# Altium schematic sheet Sheet3.SchDoc
size A; SheetNumber: 5; SheetTotal: 6
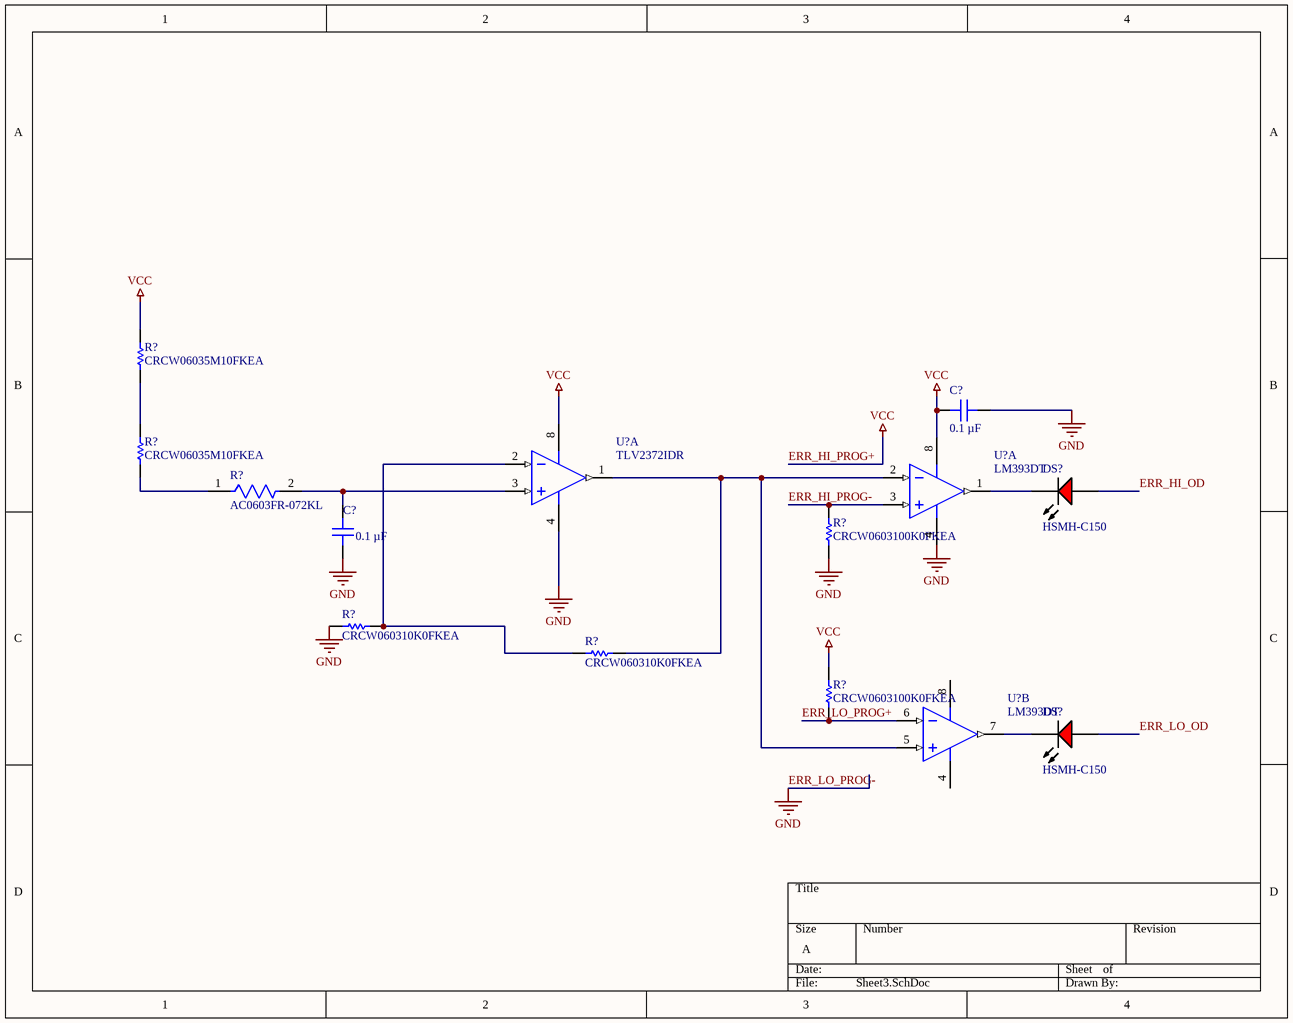
[diagram p0: Sheet3.SchDoc]

## Parts
(Parts that share a designator on the sheet are numbered #1, #2 ... from top to bottom, then left to right.)
C?#1  0.1 µF  [CAP 0603_1608]
C?#2  0.1 µF  [CAP 0603_1608]
DS?#1  HSMH-C150  [AVAG-HSMX-C150_V]
DS?#2  HSMH-C150  [AVAG-HSMX-C150_V]
R?#1  CRCW06035M10FKEA  [RESC1609X50X30NL10T20]
R?#2  CRCW06035M10FKEA  [RESC1609X50X30NL10T20]
R?#3  AC0603FR-072KL  [FP-AC0603-IPC_B]
R?#4  CRCW0603100K0FKEA  [RESC1609X50X30NL8T20]
R?#5  CRCW060310K0FKEA  [RESC1609X50X30NL8T20]
R?#6  CRCW060310K0FKEA  [RESC1609X50X30NL8T20]
R?#7  CRCW0603100K0FKEA  [RESC1609X50X30NL8T20]
U?#1  TLV2372IDR  [D0008A_M]  (part A of 2)
U?#2  LM393DT  [STM-SO-8_D_L]  (part A of 2)
U?#3  LM393DT  [STM-SO-8_D_L]  (part B of 2)

## Nets
ERR_HI_PROG+: C?#1.2 R?#1.2 R?#7.1 U?#1.8(VDD) U?#2.8(VCC+)  [also labelled VCC]
ERR_LO_PROG-: C?#1.1 C?#2.1 R?#4.2 R?#5.1 U?#1.4(GND) U?#2.4(VCC-)  [also labelled GND]
ERR_HI_OD: DS?#1.1(A)
ERR_HI_PROG-: R?#4.1 U?#2.3(IN1+)
ERR_LO_OD: DS?#2.1(A)
ERR_LO_PROG+: R?#7.2 U?#3.6(IN2-)
NetC?#2_2: C?#2.2 R?#3.2 U?#1.3(IN1+)
NetDS?#1_2: DS?#1.2(K) U?#2.1(OUT1)
NetDS?#2_2: DS?#2.2(K) U?#3.7(OUT2)
NetR?#1_1: R?#1.1 R?#2.2
NetR?#2_1: R?#2.1 R?#3.1
NetR?#5_2: R?#5.2 R?#6.1 U?#1.2(IN1-)
NetR?#6_2: R?#6.2 U?#1.1(OUT1) U?#2.2(IN1-) U?#3.5(IN2+)

Not connected (* = marked no-connect by the designer): U?#3 4(VCC-) 8(VCC+)

## Library data of the parts
C?#1 C?#2 = C0603X104J5RACAUTO: CAP CER 0.1UF 50V X7R 0603; manufacturer: KEMET; Tolerance: ±5%; Part Number: C0603X104J5RACAUTO; Value: 0.1 µF; Applications: Automotive, Boardflex Sensitive; Capacitance: 0.1 µF; componentlink1description: Datasheet; componentlink1url: https://api.kemet.com/component-edge/download/specsheet/C0603X104J5RACAUTO.pdf; componentlink2description: DigiKey Link; componentlink2url: https://www.digikey.com/en/products/detail/kemet/C0603X104J5RACAUTO/3314905; Device Package: 0603 (1608 Metric); Features: Soft Termination; lastupdated: 2/9/2024 8:10:26 PM; Lifecycle Status: Active; Minimum Order: 1; Mounting Type: Surface Mount, MLCC; Operating Temperature: -55°C ~ 125°C; Package / Case: 0603 (1608 Metric); packaging: TapeAndReel; partid: 40909; Part Status: Active; price: 0.12; Ratings: AEC-Q200; series: SMD Auto X7R Flex; Size / Dimension: 0.063" L x 0.031" W (1.60mm x 0.80mm); Supplier 1: DigiKey; Supplier Part Number 1: 399-6910-1-ND; Temperature Coefficient: X7R; Thickness (Max): 0.037" (0.95mm); Voltage - Rated: 50V
DS?#1 DS?#2 = CMP-2000-06426-1: LED Uni-Color Red, 65 mW, 25 mA, -40 to 85 degC, 2-Pin SMD, RoHS, Tape and Reel; Manufacturer: Avago; Product Height (mm): 1.1mm; Power Dissipation: 78W; Product Length (mm): 3.2mm; Forward Voltage: 2.6V; Luminous Intensity: 17mcd; DELETED: Compliant; Shape Type: Rectangular; Peak Wavelength: 660nm; Main Category: ChipLED; Dominant Wave Length: 639nm; Rad Hardened: No; Lens Type: ColorlessDiffused; Product Depth (mm): 1.6mm; Reverse Voltage: 5V; Forward Current: 25mA; Chip Material: GaAlAs; Test Current (It): 20mA; Viewing Angle: 170deg; Number of  Elements: 1; Type: Uni-Color; Package Reference: HSMX-C150; Package Description: 2-Pin Surface Mount Device, Body 3.2 x 1.6 mm; Operating Temp Range: -40Cto85C; Mounting: SurfaceMount; Emitting Color: Red; Pin Count: 2; Operating Temperature Classification: Industrial; Datasheet URL: http://media.digikey.com/pdf/Data%20Sheets/Avago%20PDFs/HSMz-Czzz.pdf; Package Type: ChipLed; Mounting Technology: SurfaceMount; High Brightness: No; Lens Dimensions: 2x1.6x0.6mm; Manufacturer URL: http://www.avagotech.com/; Lum Intensity: 17mcd; Datasheet Version: 03/2012; Packaging: TapeandReel
R?#1 R?#2 = CMP-2000-03491-1: Manufacturer: Vishay Dale; Part Number: CRCW06035M10FKEA
R?#3 = CMP-2000-04836-2: RES 2kΩ 1.00% 0.1W 0603; Resistance: 2kR; Voltage Rating: 50V; Max Power Dissipation: 100mW; Temperature Coefficient: 100ppm/°C; Tolerance: 1%; Height: 0.45mm; Case Code (Imperial): 0603; Number of Terminations: 2; Termination: SMD/SMT; Max Operating Temperature: 155°C; Min Operating Temperature: -55°C; Features: Moisture Resistant; Size Code: 0603; Military Standard: Not; Depth: 0.8mm; Lead Free: Lead Free; Ratings: AEC-Q200; Case Code (Metric): 1608; Power Rating: 100mW; Resistor Type: Thick Film; Length: 1.6mm; Case/Package: 0603; Packaging: Tape and Reel; Width: 0.8mm; Construction: Rectangular; Series: AC
R?#4 R?#7 = CMP-1666-00005-4: Chip Resistor, 100 KOhm, +/- 1%, 100 mW, -55 to 155 degC, 0603 (1608 Metric), RoHS, Tape and Reel; Manufacturer: Vishay Semiconductor; Voltage Rating: 75 V; Max Operating Temperature: 155 degC; PackageDescription: 2-Pin Surface Mount Device, Body 1.575 x 0.85 mm; ComponentLink1Description: Manufacturer URL; RoHSCompliant: true; PackageReference: 0603; REACH SVHC: Unknown; Length: 1.55 mm; DatasheetVersion: 06/2012; Packaging: Tape and Reel; Min Operating Temperature: -55 degC; Mounting Technology: Surface Mount; ComponentLink2URL: https://datasheet.ciiva.com/11809/0900766b80d98afc-11809037.pdf; Height: 0.45 mm; ComponentLink2Description: Datasheet; Package Quantity: 5000; ComponentLink1URL: http://www.vishay.com/
R?#5 R?#6 = CMP-1666-00005-4: Chip Resistor, 10 KOhm, +/- 1%, 100 mW, -55 to 155 degC, 0603 (1608 Metric), RoHS, Tape and Reel; Manufacturer: Vishay Semiconductor; Voltage Rating: 75 V; Max Operating Temperature: 155 degC; PackageDescription: 2-Pin Surface Mount Device, Body 1.575 x 0.85 mm; ComponentLink1Description: Manufacturer URL; RoHSCompliant: true; PackageReference: 0603; REACH SVHC: Unknown; Length: 1.55 mm; DatasheetVersion: 06/2012; Packaging: Tape and Reel; Min Operating Temperature: -55 degC; Mounting Technology: Surface Mount; ComponentLink2URL: https://datasheet.ciiva.com/11809/0900766b80d98afc-11809037.pdf; Height: 0.45 mm; ComponentLink2Description: Datasheet; Package Quantity: 5000; ComponentLink1URL: http://www.vishay.com/
U?#1 = CMP-0272-02948-3: 550 uA/Ch, 3 MHz, RRIO Operational Amplifier, 2.7 to 16 V, -40 to 125 degC, 8-pin SOIC (D8), Green (RoHS & no Sb/Br); Manufacturer: Texas Instruments; GBW(Typ)(MHz): 3; Offset Drift(Typ)(uV/C): 2; Total Supply Voltage(Max)(+5V is 5, +/-5V is 10): 16; Vio (25C)(Max)(mV): 4.5; Iq per channel(Max)(mA): 0.9; Packing: LARGE T&R; Sub Family: Low Supply Voltage Amplifier (<=2.7V), Precision Amplifier; IIB(Max)(pA): 60; Rating: Catalog; CMRR(Min)(dB): 50; Total Supply Voltage(Min)(+5V is 5, +/-5V is 10): 2.7; Slew Rate(Typ)(V/us): 2.4; ComponentLink1URL: http://www.ti.com/; ComponentLink2Description: Datasheet; PartNumber: TLV2372IDR; Code_JEDEC: MS-012; PackageDescription: 8-Pin Plastic Small Outline, Body 4.9 x 3.9 mm, Pitch 1.27 mm; ComponentLink1Description: Manufacturer URL; DatasheetVersion: SLOS270D; ComponentLink3Description: Package Specification; ComponentLink2URL: http://www.ti.com/lit/ds/symlink/tlv2372.pdf; ComponentLink3URL: http://www.ti.com/litv/pdf/msoi002j; Mounting Technology: Surface Mount; PackageVersion: 4040047-3/M, 06/2011; Eco-Plan: Green (RoHS & no Sb/Br); Number of Channels: 2; PackageReference: D0008A
U?#2 U?#3 = CMP-2000-06550-1: Low-Power, Dual-Voltage Comparator, 2 to 36 V, 0 to 70 degC, 8-Pin SOIC (SO), RoHS, Tape and Reel; Manufacturer: STMicroelectronics; Voltage - Supply, Single/Dual (±): 2V~36V,±1V~18V; Current - Input Bias (Max): 0.25µA@5V; Number of Elements: 2; Current - Output (Typ): 18mA@5V; Other Names: 497-1593-2; Voltage - Input Offset (Max): 5mV@30V; Output Type: CMOS,DTL,ECL,MOS,Open-Collector,TTL; EDA / CAD Models: DownloadfromAcceleratedDesigns; Other Related Documents: LM393ViewAllSpecificationsLM393ViewAllSpecifications; Online Catalog: Comparators-2elements; Current - Quiescent (Max): 2.5mA; Standard Package: 2,500; Manufacturer URL: http://www.st.com/; Package Description: 8-Pin Small Outline Integrated Circuit, Body 4.9 x 3.9 mm, Pitch 1.27 mm; Packaging: Tape&Reel(TR); Datasheet Version: Rev. 15, 02/2016; Category: IntegratedCircuits(ICs); Operating Temperature: 0°C~70°C; Mounting Type: SurfaceMount; Supplier Device Package: 8-SO; Datasheet URL: http://www.st.com/content/ccc/resource/technical/document/datasheet/group1/b4/cc/cf/13/18/28/44/f5/CD00000465/files/CD00000465.pdf/jcr:content/translations/en.CD00000465.pdf; Family: Linear-Comparators; Mounting Technology: SurfaceMount; Type: GeneralPurpose; Package Reference: SO-8; Package / Case: 8-SOIC(0.154",3.90mmWidth)